# Altium schematic sheet mipi_serializer2.SchDoc
size A3; DrawnBy: Elio F; Engineer: Elio F; Revision: A; SheetNumber: 9; SheetTotal: 11; Sheet Title: Mipi Serializer CAM2
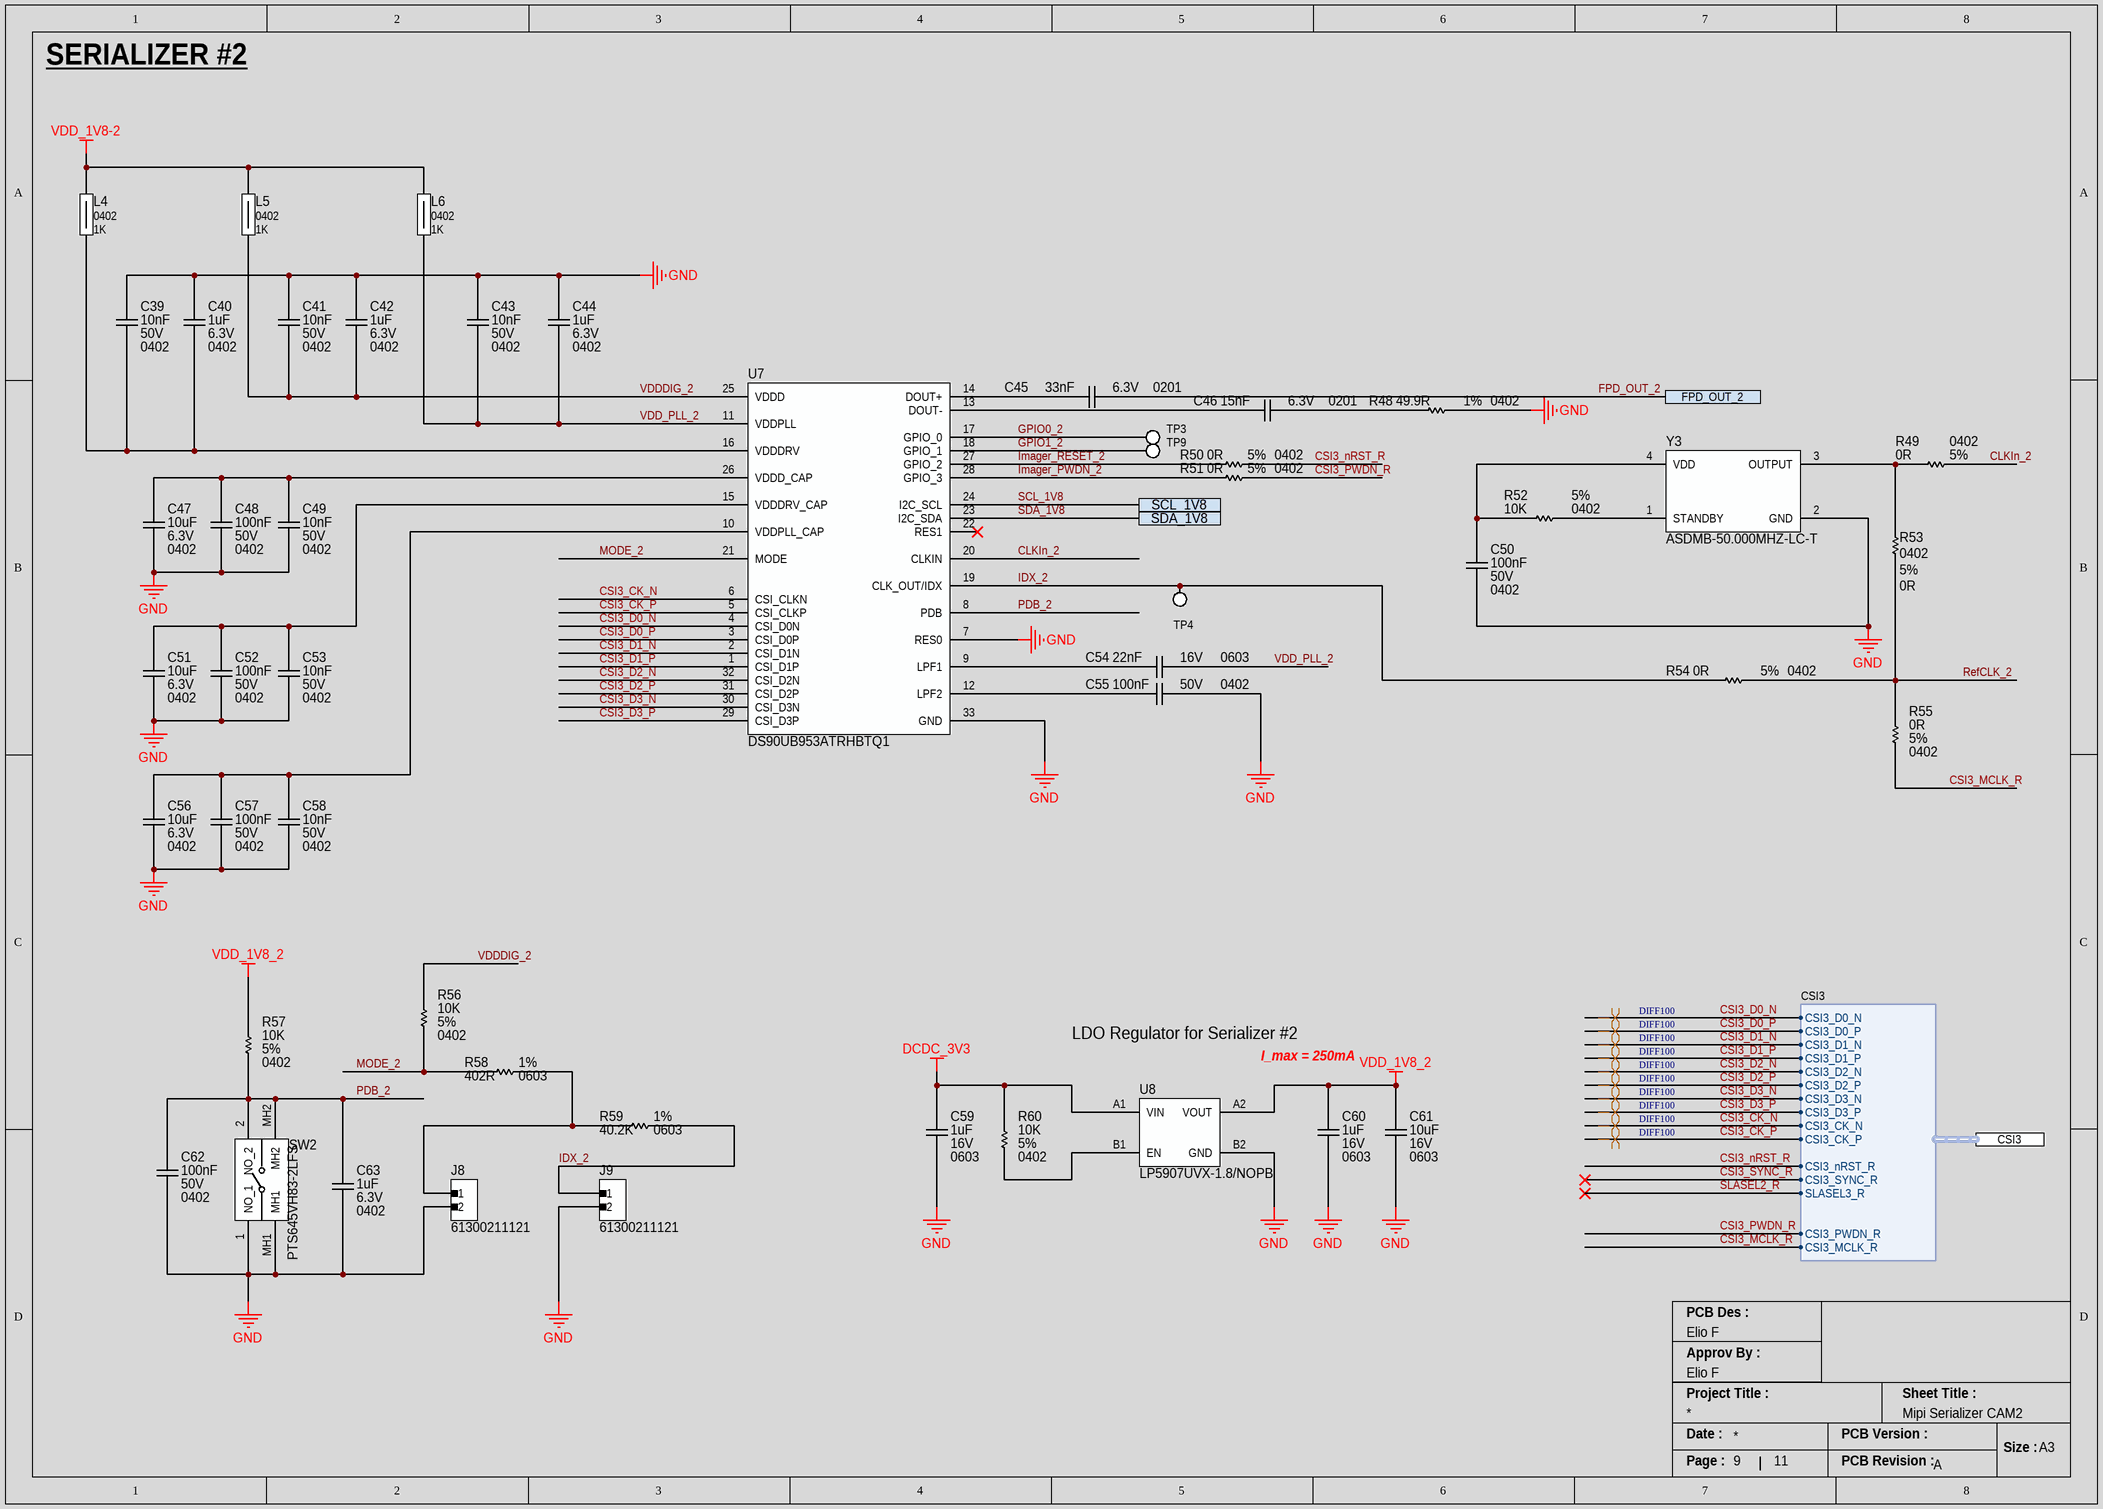
[diagram p0: mipi_serializer2.SchDoc]

## Parts
C39  Voltage Rating: 50V  Capacitance: 10nF  Case/Package: 0402  [CAP_0402_CAPC1005X05N]  (hidden comment: GRM155R71H103KA88D)
C40  Capacitance: 1uF  Voltage Rating: 6.3V  Case Code (Imperial): 0402  [CAP_0402_CAPC1005X05N]  (hidden comment: CL05B105KQ5NQNC)
C41  Voltage Rating: 50V  Capacitance: 10nF  Case/Package: 0402  [CAP_0402_CAPC1005X05N]  (hidden comment: GRM155R71H103KA88D)
C42  Capacitance: 1uF  Voltage Rating: 6.3V  Case Code (Imperial): 0402  [CAP_0402_CAPC1005X05N]  (hidden comment: CL05B105KQ5NQNC)
C43  Voltage Rating: 50V  Capacitance: 10nF  Case/Package: 0402  [CAP_0402_CAPC1005X05N]  (hidden comment: GRM155R71H103KA88D)
C44  Capacitance: 1uF  Voltage Rating: 6.3V  Case Code (Imperial): 0402  [CAP_0402_CAPC1005X05N]  (hidden comment: CL05B105KQ5NQNC)
C45  Voltage Rating: 6.3V  Capacitance: 33nF  Case/Package: 0201  [CAP_0201_CAPC0603X03N]  (hidden comment: GRM033R60J333KE01D)
C46  Voltage Rating: 6.3V  Capacitance: 15nF  Case/Package: 0201  [CAP_0201_CAPC0603X03N]  (hidden comment: GRM033R60J153KE01D)
C47  Case/Package: 0402  Capacitance: 10uF  Voltage Rating: 6.3V  [CAP_0402_CAPC1005X05N]  (hidden comment: CL05A106MQ5NUNC)
C48  Voltage Rating: 50V  Capacitance: 100nF  Case/Package: 0402  [CAP_0402_CAPC1005X05N]  (hidden comment: GRM155R71H104KE14D)
C49  Voltage Rating: 50V  Capacitance: 10nF  Case/Package: 0402  [CAP_0402_CAPC1005X05N]  (hidden comment: GRM155R71H103KA88D)
C50  Voltage Rating: 50V  Capacitance: 100nF  Case/Package: 0402  [CAP_0402_CAPC1005X05N]  (hidden comment: GRM155R71H104KE14D)
C51  Case/Package: 0402  Capacitance: 10uF  Voltage Rating: 6.3V  [CAP_0402_CAPC1005X05N]  (hidden comment: CL05A106MQ5NUNC)
C52  Voltage Rating: 50V  Capacitance: 100nF  Case/Package: 0402  [CAP_0402_CAPC1005X05N]  (hidden comment: GRM155R71H104KE14D)
C53  Voltage Rating: 50V  Capacitance: 10nF  Case/Package: 0402  [CAP_0402_CAPC1005X05N]  (hidden comment: GRM155R71H103KA88D)
C54  Voltage Rating (DC): 16V  Capacitance: 22nF  Case/Package: 0603  [CAP_0603_CAPC1608X08N]  (hidden comment: C0603C223K4RACTU)
C55  Voltage Rating: 50V  Capacitance: 100nF  Case/Package: 0402  [CAP_0402_CAPC1005X05N]  (hidden comment: GRM155R71H104KE14D)
C56  Case/Package: 0402  Capacitance: 10uF  Voltage Rating: 6.3V  [CAP_0402_CAPC1005X05N]  (hidden comment: CL05A106MQ5NUNC)
C57  Voltage Rating: 50V  Capacitance: 100nF  Case/Package: 0402  [CAP_0402_CAPC1005X05N]  (hidden comment: GRM155R71H104KE14D)
C58  Voltage Rating: 50V  Capacitance: 10nF  Case/Package: 0402  [CAP_0402_CAPC1005X05N]  (hidden comment: GRM155R71H103KA88D)
C59  Voltage Rating: 16V  Capacitance: 1uF  Case/Package: 0603  [CAP_0603_CAPC1608X08N]  (hidden comment: CL10A105KO8NNNC)
C60  Voltage Rating: 16V  Capacitance: 1uF  Case/Package: 0603  [CAP_0603_CAPC1608X08N]  (hidden comment: CL10A105KO8NNNC)
C61  Voltage Rating: 16V  Capacitance: 10uF  Case/Package: 0603  [CAP_0603_CAPC1608X08N]  (hidden comment: GRM188R61C106MAALD)
C62  Voltage Rating: 50V  Capacitance: 100nF  Case/Package: 0402  [CAP_0402_CAPC1005X05N]  (hidden comment: GRM155R71H104KE14D)
C63  Capacitance: 1uF  Voltage Rating: 6.3V  Case Code (Imperial): 0402  [CAP_0402_CAPC1005X05N]  (hidden comment: CL05B105KQ5NQNC)
J8  61300211121  [HEADER_MALE_HDRV2W110P0X254_1X2_508X254X854P]
J9  61300211121  [HEADER_MALE_HDRV2W110P0X254_1X2_508X254X854P]
L4  Case/Package: 0402  Impedance: 1K  [IND_0402]  (hidden comment: *BLM15AX102SN1D)
L5  Case/Package: 0402  Impedance: 1K  [IND_0402]  (hidden comment: *BLM15AX102SN1D)
L6  Case/Package: 0402  Impedance: 1K  [IND_0402]  (hidden comment: *BLM15AX102SN1D)
R48  Resistance: 49.9R  Tolerance: 1%  Case/Package: 0402  [RES_0402_RESC1005X04N]  (hidden comment: CR0402-FX-49R9GLF)
R49  Case Code (Imperial): 0402  Tolerance: 5%  Resistance: 0R  [RES_0402_RESC1005X04N]  (hidden comment: ERJ-2GE0R00X)
R50  Case Code (Imperial): 0402  Tolerance: 5%  Resistance: 0R  [RES_0402_RESC1005X04N]  (hidden comment: ERJ-2GE0R00X)
R51  Case Code (Imperial): 0402  Tolerance: 5%  Resistance: 0R  [RES_0402_RESC1005X04N]  (hidden comment: ERJ-2GE0R00X)
R52  Tolerance: 5%  Resistance: 10K  Case/Package: 0402  [RES_0402_RESC1005X04N]  (hidden comment: ERJ-2GEJ103X)
R53  Case Code (Imperial): 0402  Tolerance: 5%  Resistance: 0R  [RES_0402_RESC1005X04N]  (hidden comment: ERJ-2GE0R00X)
R54  Case Code (Imperial): 0402  Tolerance: 5%  Resistance: 0R  [RES_0402_RESC1005X04N]  (hidden comment: ERJ-2GE0R00X)
R55  Case Code (Imperial): 0402  Tolerance: 5%  Resistance: 0R  [RES_0402_RESC1005X04N]  (hidden comment: ERJ-2GE0R00X)
R56  Tolerance: 5%  Resistance: 10K  Case/Package: 0402  [RES_0402_RESC1005X04N]  (hidden comment: ERJ-2GEJ103X)
R57  Tolerance: 5%  Resistance: 10K  Case/Package: 0402  [RES_0402_RESC1005X04N]  (hidden comment: ERJ-2GEJ103X)
R58  Tolerance: 1%  Resistance: 402R  Case/Package: 0603  [RES_0603_RESC1608X04N]  (hidden comment: CRCW0603402RFKEA)
R59  Tolerance: 1%  Resistance: 40.2K  Case/Package: 0603  [RES_0603_RESC1608X04N]  (hidden comment: RC0603FR-0740K2L)
R60  Tolerance: 5%  Resistance: 10K  Case/Package: 0402  [RES_0402_RESC1005X04N]  (hidden comment: ERJ-2GEJ103X)
SW2  PTS645VH83-2LFS  [SW_RA_PTS645VH832LFS]
TP3  NO COMPONENT  [TP_PAD_1.6MM_SMD_ROUND]  (value not drawn)  (no BOM)
TP4  NO COMPONENT  [TP_PAD_1.6MM_SMD_ROUND]  (value not drawn)  (no BOM)
TP9  NO COMPONENT  [TP_PAD_1.6MM_SMD_ROUND]  (value not drawn)  (no BOM)
U7  DS90UB953ATRHBTQ1  [IC_SERIALIZER_QFN50P500X500X100-33N-D]
U8  LP5907UVX-1.8/NOPB  [IC_REG_LDO_BGA4C35P2X2_71X71X40]
Y3  ASDMB-50.000MHZ-LC-T  [XTAL_ASDMB-50.000MHZ-LC-T]

## Ports
CSI3 (harness CSI3), FPD_OUT_2, SCL_1V8, SDA_1V8

## Harnesses
CSI3: CSI3_D0_N, CSI3_D0_P, CSI3_D1_N, CSI3_D1_P, CSI3_D2_N, CSI3_D2_P, CSI3_D3_N, CSI3_D3_P, CSI3_CK_N, CSI3_CK_P, CSI3_nRST_R, CSI3_SYNC_R, SLASEL3_R, CSI3_PWDN_R, CSI3_MCLK_R

## Nets
DCDC_3V3: C59.2 R60.2 U8.A1(VIN)
GND: C39.2 C40.2 C41.2 C42.2 C43.2 C44.2 C47.1 C48.1 C49.1 C50.1 C51.1 C52.1 C53.1 C55.1 C56.1 C57.1 C58.1 C59.1 C60.1 C61.1 C62.1 C63.1 J8.2 J9.2 R48.2 SW2.1(NO_1) SW2.MH1 U7.7(RES0) U7.33(GND) U8.B2(GND) Y3.2(GND)
VDD_1V8-2: L4.2 L5.2 L6.2
VDD_1V8_2: C60.2 C61.2 R57.2 U8.A2(VOUT)
CLKIn_2: R49.2 U7.20(CLKIN)
CSI3_CK_N: U7.6(CSI_CLKN) ; port CSI3.CSI3_CK_N
CSI3_CK_P: U7.5(CSI_CLKP) ; port CSI3.CSI3_CK_P
CSI3_D0_N: U7.4(CSI_D0N) ; port CSI3.CSI3_D0_N
CSI3_D0_P: U7.3(CSI_D0P) ; port CSI3.CSI3_D0_P
CSI3_D1_N: U7.2(CSI_D1N) ; port CSI3.CSI3_D1_N
CSI3_D1_P: U7.1(CSI_D1P) ; port CSI3.CSI3_D1_P
CSI3_D2_N: U7.32(CSI_D2N) ; port CSI3.CSI3_D2_N
CSI3_D2_P: U7.31(CSI_D2P) ; port CSI3.CSI3_D2_P
CSI3_D3_N: U7.30(CSI_D3N) ; port CSI3.CSI3_D3_N
CSI3_D3_P: U7.29(CSI_D3P) ; port CSI3.CSI3_D3_P
CSI3_MCLK_R: R55.1 ; port CSI3.CSI3_MCLK_R
CSI3_nRST_R: R50.2 ; port CSI3.CSI3_nRST_R
CSI3_PWDN_R: R51.2 ; port CSI3.CSI3_PWDN_R
CSI3_SYNC_R: port CSI3.CSI3_SYNC_R
FPD_OUT_2: C45.2 ; port FPD_OUT_2
GPIO0_2: TP3.1 U7.17(GPIO_0)
GPIO1_2: TP9.1 U7.18(GPIO_1)
IDX_2: J9.1 R54.2 R59.2 TP4.1 U7.19(CLK_OUT/IDX)
Imager_PWDN_2: R51.1 U7.28(GPIO_3)
Imager_RESET_2: R50.1 U7.27(GPIO_2)
MODE_2: R56.1 R58.1 U7.21(MODE)
PDB_2: C62.2 C63.2 R57.1 SW2.2(NO_2) SW2.MH2 U7.8(PDB)
RefCLK_2: R53.1 R54.1 R55.2
SCL_1V8: U7.24(I2C_SCL) ; port SCL_1V8
SDA_1V8: U7.23(I2C_SDA) ; port SDA_1V8
SLASEL2_R: port CSI3.SLASEL3_R
VDD_PLL_2: C43.1 C44.1 C54.2 L6.1 U7.11(VDDPLL)
VDDDIG_2: C41.1 C42.1 L5.1 R56.2 U7.25(VDDD)
NetC39_1: C39.1 C40.1 L4.1 U7.16(VDDDRV)
NetC45_1: C45.1 U7.14(DOUT+)
NetC46_1: C46.1 U7.13(DOUT-)
NetC46_2: C46.2 R48.1
NetC47_2: C47.2 C48.2 C49.2 U7.26(VDDD_CAP)
NetC50_2: C50.2 R52.1 Y3.4(VDD)
NetC51_2: C51.2 C52.2 C53.2 U7.15(VDDDRV_CAP)
NetC54_1: C54.1 U7.9(LPF1)
NetC55_2: C55.2 U7.12(LPF2)
NetC56_2: C56.2 C57.2 C58.2 U7.10(VDDPLL_CAP)
NetJ8_1: J8.1 R58.2 R59.1
NetR49_1: R49.1 R53.2 Y3.3(OUTPUT)
NetR52_2: R52.2 Y3.1(STANDBY)
NetR60_1: R60.1 U8.B1(EN)

Not connected (* = marked no-connect by the designer): U7 22(RES1)*

## Layout directives
differential pair; differential pair class DIFF100: CSI3_CK_N, CSI3_CK_P, CSI3_D0_N, CSI3_D0_P, CSI3_D1_N, CSI3_D1_P, CSI3_D2_N, CSI3_D2_P, CSI3_D3_N, CSI3_D3_P

## Notes on the sheet
- SERIALIZER #2
- LDO Regulator for Serializer #2
- I_max = 250mA
- PCB Des :
- Approv By :
- Project Title :
- Sheet Title :
- Date :
- PCB Version :
- Size :
- A3
- Page :
- PCB Revision :

## Library data of the parts
C39 C41 C43 C49 C53 C58 = CAP_10nF_50V_X7R_0402: Multilayer Ceramic Capacitors MLCC Surface Mount 0402 0.01uF 50 Volts X7R 10%; Manufacturer: Murata; Voltage: 25V; Supplier 1: Digikey; Manufacturer Part Number: GRM155R71H103KA88D; RoHS: Yes; Category: Ceramic Capacitors; Stock 1: 5190059; Pricing 1: 1=0.1, 10=0.023, 50=0.013, 100=0.0101, 500=0.0076, 1000=0.00598, 2500=0.00543, 5000=0.005 (USD); Mount: Surface Mount; Number of Pins: 2; Case Code (Metric): 1005; Case Code (Imperial): 0402; Material: Ceramic; Min Operating Temperature: -55°C; Max Operating Temperature: 125°C; Tolerance: 10%; Packaging: Tape and Reel; Package Quantity: 1; Dielectric: X7R; Termination: SMD/SMT; Series: GRM; Construction: Flat; Voltage Rating (DC): 50V; Length: 1mm; Width: 0.02inch; Height: 0.5mm; Thickness: 0.022inch; Depth: 0.5mm; Radiation Hardening: No; Reach SVHC Compliant: No; RoHS Compliant: Yes; Lead Free: 5697LeadFree; ComponentLink1URL: https://datasheet.ciiva.com/22698/1747449-22698420.pdf?src-supplier=Element14; ComponentLink1Description: https://datasheet.ciiva.com/22698/1747449-22698420.pdf?src-supplier=Element14; ComponentLink2URL: https://datasheet.ciiva.com/19476/1856433-19476546.pdf?src-supplier=Jameco; ComponentLink2Description: https://datasheet.ciiva.com/19476/1856433-19476546.pdf?src-supplier=Jameco; ComponentLink3URL: https://datasheet.ciiva.com/129/product-129810.pdf?src-supplier=Digikey; ComponentLink3Description: https://datasheet.ciiva.com/129/product-129810.pdf?src-supplier=Digikey; ComponentLink4URL: https://datasheet.ciiva.com/11786/0900766b80ef921d-11786340.pdf?src-supplier=Rs; ComponentLink4Description: https://datasheet.ciiva.com/11786/0900766b80ef921d-11786340.pdf?src-supplier=Rs; ComponentLink5URL: https://datasheet.ciiva.com/18100/getdatasheetpartid-27434-18100660.pdf?src-supplier=Verical; ComponentLink5Description: https://datasheet.ciiva.com/18100/getdatasheetpartid-27434-18100660.pdf?src-supplier=Verical; ComponentLink6URL: https://datasheet.ciiva.com/29199/454225-da-01-en-vs-kondensator-0402-29199740.pdf?src-supplier=Conrad; ComponentLink6Description: https://datasheet.ciiva.com/29199/454225-da-01-en-vs-kondensator-0402-29199740.pdf?src-supplier=Conrad; ComponentLink7URL: https://datasheet.ciiva.com/129/grm155r71h103ka88-01-129811.pdf?src-supplier=Digikey; ComponentLink7Description: https://datasheet.ciiva.com/129/grm155r71h103ka88-01-129811.pdf?src-supplier=Digikey; ComponentLink8URL: https://datasheet.ciiva.com/129/grm155r71h103ka88-01-129812.pdf?src-supplier=Digikey; ComponentLink8Description: https://datasheet.ciiva.com/129/grm155r71h103ka88-01-129812.pdf?src-supplier=Digikey; ComponentLink9URL: https://datasheet.ciiva.com/5410/product-5410990.pdf?src-supplier=Mouser; ComponentLink9Description: https://datasheet.ciiva.com/5410/product-5410990.pdf?src-supplier=Mouser; ComponentLink10URL: https://datasheet.ciiva.com/16495/product-16495290.pdf?src-supplier=Future+Electronics; ComponentLink10Description: https://datasheet.ciiva.com/16495/product-16495290.pdf?src-supplier=Future+Electronics; Supplier Part Number 1: 490-4516-6-ND
C40 C42 C44 C63 = CAP_1uF_6.3V_X7R_0402: Multilayer Ceramic Capacitor, 1 uF, 6.3 V, ï¿½ 10%, X7R, 0402 [1005 Metric]; Manufacturer: Samsung; Supplier 1: Digikey; Manufacturer Part Number: CL05B105KQ5NQNC; RoHS: Yes; Category: Ceramic Capacitors; Stock 1: 242595; Pricing 1: 1=0.15, 10=0.099, 50=0.0594, 100=0.0467, 500=0.0345, 1000=0.02856, 2500=0.02658, 5000=0.02432 (USD); Mount: Surface Mount; Case/Package: 0402; Case Code (Metric): 1005; Material: Ceramic; Min Operating Temperature: -55°C; Max Operating Temperature: 125°C; Tolerance: 10%; Packaging: Tape and Reel; Package Quantity: 1; Series: CL; Length: 0.039inch; Width: 0.02inch; Thickness: 0.022inch; Depth: 0.5mm; Lead Free: Lead Free; RoHS Compliant: Yes; ComponentLink1URL: https://datasheet.ciiva.com/25797/cl05b105kq5nqnc-25797457.pdf?src-supplier=Digikey; ComponentLink1Description: https://datasheet.ciiva.com/25797/cl05b105kq5nqnc-25797457.pdf?src-supplier=Digikey; Supplier Part Number 1: 1276-1513-1-ND; Dielectric: X7R
C45 = CAP_0.033uF_6.3V_X5R_0201: Multilayer Ceramic Capacitor, 0.033 uF, 6.3 V, ± 10%, X5R, 0201 [0603 Metric]; Manufacturer: Murata; Dissipation Factor: 0.1%; Supplier 1: Mouser; Manufacturer Part Number: GRM033R60J333KE01D; RoHS: Yes; Category: Ceramic Capacitors; Stock 1: 164761; Pricing 1: 1=0.1, 10=0.017, 50=0.017, 100=0.011, 1000=0.01, 10000=0.008 (USD); Mount: Surface Mount; Case Code (Metric): 0603; Case Code (Imperial): 0201; Material: Ceramic; Min Operating Temperature: -55°C; Max Operating Temperature: 85°C; Tolerance: 10%; Packaging: Tape and Reel; Voltage Rating (DC): 6.3V; Package Quantity: 1; Dielectric: X5R; Termination: SMD/SMT; Voltage: 6.3V; Series: GRM; Construction: Flat; Length: 0.6mm; Width: 0.012inch; Height: 0.3mm; Thickness: 0.013inch; Depth: 0.3mm; Radiation Hardening: No; Reach SVHC Compliant: No; Lead Free: Lead Free; RoHS Compliant: Yes; ComponentLink1URL: https://datasheet.ciiva.com/131/product-131104.pdf?src-supplier=Digikey; ComponentLink1Description: https://datasheet.ciiva.com/131/product-131104.pdf?src-supplier=Digikey; ComponentLink2URL: https://datasheet.ciiva.com/18184/getdatasheetpartid-220776-18184045.pdf?src-supplier=Verical; ComponentLink2Description: https://datasheet.ciiva.com/18184/getdatasheetpartid-220776-18184045.pdf?src-supplier=Verical; ComponentLink3URL: https://datasheet.ciiva.com/29199/455665-da-01-en-vs-kondensator-0201-29199269.pdf?src-supplier=Conrad; ComponentLink3Description: https://datasheet.ciiva.com/29199/455665-da-01-en-vs-kondensator-0201-29199269.pdf?src-supplier=Conrad; ComponentLink4URL: https://datasheet.ciiva.com/11605/product-11605453.pdf?src-supplier=Avnet; ComponentLink4Description: https://datasheet.ciiva.com/11605/product-11605453.pdf?src-supplier=Avnet; ComponentLink5URL: https://datasheet.ciiva.com/16199/product-16199350.pdf?src-supplier=Future+Electronics; ComponentLink5Description: https://datasheet.ciiva.com/16199/product-16199350.pdf?src-supplier=Future+Electronics; Supplier Part Number 1: 81-GRM033R60J333KE01
C46 = CAP_0.015uF_6.3V_X5R_0201: 0201 15 nF 6.3 V ±10% Tolerance X5R SMT Multilayer Ceramic Capacitor; Manufacturer: Murata; Supplier 1: Mouser; Manufacturer Part Number: GRM033R60J153KE01D; RoHS: Yes; Category: Ceramic Capacitors; Stock 1: 84989; Pricing 1: 1=0.1, 10=0.014, 50=0.014, 100=0.007, 1000=0.005, 10000=0.005 (USD); Mount: Surface Mount; Case Code (Metric): 0603; Case Code (Imperial): 0201; Material: Ceramic; Min Operating Temperature: -55°C; Max Operating Temperature: 85°C; Package Quantity: 1; Tolerance: 10%; Packaging: Tape and Reel; Voltage Rating (DC): 6.3V; Dielectric: X5R; Termination: SMD/SMT; Series: GRM; Construction: Flat; Length: 0.6mm; Width: 0.012inch; Height: 0.3mm; Thickness: 0.013inch; Depth: 0.3mm; Radiation Hardening: No; Lead Free: Lead Free; RoHS Compliant: Yes; ComponentLink1URL: https://datasheet.ciiva.com/130/product-130817.pdf?src-supplier=Digikey; ComponentLink1Description: https://datasheet.ciiva.com/130/product-130817.pdf?src-supplier=Digikey; ComponentLink2URL: https://datasheet.ciiva.com/18184/getdatasheetpartid-306886-18184038.pdf?src-supplier=Verical; ComponentLink2Description: https://datasheet.ciiva.com/18184/getdatasheetpartid-306886-18184038.pdf?src-supplier=Verical; ComponentLink3URL: https://datasheet.ciiva.com/29199/455637-da-01-en-vs-kondensator-0201-29199258.pdf?src-supplier=Conrad; ComponentLink3Description: https://datasheet.ciiva.com/29199/455637-da-01-en-vs-kondensator-0201-29199258.pdf?src-supplier=Conrad; ComponentLink4URL: https://datasheet.ciiva.com/130/grm033r60j153ke01-01-130818.pdf?src-supplier=Digikey; ComponentLink4Description: https://datasheet.ciiva.com/130/grm033r60j153ke01-01-130818.pdf?src-supplier=Digikey; ComponentLink5URL: https://datasheet.ciiva.com/130/grm033r60j153ke01-01-130819.pdf?src-supplier=Digikey; ComponentLink5Description: https://datasheet.ciiva.com/130/grm033r60j153ke01-01-130819.pdf?src-supplier=Digikey; ComponentLink6URL: https://datasheet.ciiva.com/11619/product-11619495.pdf?src-supplier=Avnet; ComponentLink6Description: https://datasheet.ciiva.com/11619/product-11619495.pdf?src-supplier=Avnet; Supplier Part Number 1: 81-GRM033R60J153KE1D
C47 C51 C56 = CAP_10UF_6.3V_X5R_0402: Cap Ceramic 10uF 6.3V X5R 20% SMD 0402 85C T/R; Manufacturer: Samsung; Supplier 1: Digikey; Manufacturer Part Number: CL05A106MQ5NUNC; RoHS: Yes; Category: Ceramic Capacitors; Stock 1: 6097180; Pricing 1: 1=0.24, 10=0.153, 50=0.0968, 100=0.0774, 500=0.05588, 1000=0.04943, 2500=0.04728, 5000=0.04299 (USD); Mount: Surface Mount; Case Code (Metric): 1005; Case Code (Imperial): 0402; Min Operating Temperature: -55°C; Max Operating Temperature: 85°C; Packaging: Tape and Reel; Tolerance: 20%; Dielectric: X5R; Series: CL; Package Quantity: 1; Construction: Flat; Length: 1mm; Width: 0.02inch; Height: 0.5mm; Depth: 0.5mm; Thickness: 0.028inch; Radiation Hardening: No; RoHS Compliant: Yes; ComponentLink1URL: https://datasheet.ciiva.com/16437/cl05a106mq5nunc-16437356.pdf?src-supplier=Future+Electronics; ComponentLink1Description: https://datasheet.ciiva.com/16437/cl05a106mq5nunc-16437356.pdf?src-supplier=Future+Electronics; ComponentLink2URL: https://datasheet.ciiva.com/26877/getdatasheetpartid-355289-26877841.pdf?src-supplier=Verical; ComponentLink2Description: https://datasheet.ciiva.com/26877/getdatasheetpartid-355289-26877841.pdf?src-supplier=Verical; Supplier Part Number 1: 1276-1451-1-ND
C48 C50 C52 C55 C57 C62 = CAP_100NF_50V_X7R_0402: Multilayer Ceramic Capacitor, 0.1 uF, 16 V, ± 10%, X7R, 0402 [1005 Metric]; Manufacturer: Murata; Dissipation Factor: 0.025%; Temperature Coefficient: 30ppm/°C; Supplier 1: DigiKey; Manufacturer Part Number: GRM155R71H104KE14D; RoHS: Yes; Category: Ceramic Capacitors; Stock 1: 13730790; Pricing 1: 1=0.1, 10=0.023, 50=0.0132, 100=0.0102, 500=0.00768, 1000=0.00603, 2500=0.00548, 5000=0.00504 (USD); Mount: Surface Mount; Number of Pins: 2NUMBER; Case Code (Metric): 1005; Material: Ceramic; Case Code (Imperial): 0402; Weight: 0.000212oz; Dielectric Material: Ceramic; Min Operating Temperature: -55°C; Max Operating Temperature: 125°C; Packaging: Tape and Reel; Package Quantity: 10000; Series: GRM; Tolerance: 10%; Dielectric: X7R; Termination: SMD/SMT; Voltage: 50V; Voltage Rating (DC): 50V; Construction: Flat; Length: 1mm; Width: 0.5mm; Height: 0.5mm; Depth: 0.5mm; Thickness: 0.022inch; Reach SVHC Compliant: No; RoHS Compliant: Yes; Lead Free: 5697LeadFree; ComponentLink1URL: http://www.farnell.com/datasheets/2079156.pdf?src-supplier=Farnell; ComponentLink1Description: http://www.farnell.com/datasheets/2079156.pdf?src-supplier=Farnell; ComponentLink2URL: http://www.mouser.com/ds/2/281/c02e-2905.pdf?src-supplier=Mouser; ComponentLink2Description: http://www.mouser.com/ds/2/281/c02e-2905.pdf?src-supplier=Mouser; ComponentLink3URL: http://www.farnell.com/datasheets/2079156.pdf?src-supplier=Newark; ComponentLink3Description: http://www.farnell.com/datasheets/2079156.pdf?src-supplier=Newark; ComponentLink4URL: https://datasheet.octopart.com/GRM155R71H104KE14D-Murata-datasheet-22122223.pdf?src-supplier=Future+Electronics; ComponentLink4Description: https://datasheet.octopart.com/GRM155R71H104KE14D-Murata-datasheet-22122223.pdf?src-supplier=Future+Electronics; ComponentLink5URL: https://search.murata.co.jp/Ceramy/image/img/A01X/G101/ENG/GRM155R71H104KE14-01.pdf?src-supplier=Digi-Key; ComponentLink5Description: https://search.murata.co.jp/Ceramy/image/img/A01X/G101/ENG/GRM155R71H104KE14-01.pdf?src-supplier=Digi-Key; ComponentLink6URL: http://psearch.en.murata.com/capacitor/product/GRM155R71H104KE14%23.pdf?src-supplier=Avnet; ComponentLink6Description: http://psearch.en.murata.com/capacitor/product/GRM155R71H104KE14%23.pdf?src-supplier=Avnet; ComponentLink7URL: https://datasheet.octopart.com/GRM155R71H104KE14D-Murata-datasheet-66077078.pdf?src-supplier=Element14; ComponentLink7Description: https://datasheet.octopart.com/GRM155R71H104KE14D-Murata-datasheet-66077078.pdf?src-supplier=Element14; Supplier Part Number 1: 490-10700-6-ND; Supplier 2: Digikey; Stock 2: 3706055; Pricing 2: 1=0.1, 10=0.037, 50=0.021, 100=0.0162, 500=0.01224, 1000=0.00961, 2500=0.00874, 5000=0.00804 (USD); Halogen Free: 5694HalogenFree; ComponentLink8URL: http://www.mouser.com/ds/2/447/UPY-GPHC_X5R_4V-to-50V_25-1131599.pdf?src-supplier=Mouser; ComponentLink8Description: http://www.mouser.com/ds/2/447/UPY-GPHC_X5R_4V-to-50V_25-1131599.pdf?src-supplier=Mouser; ComponentLink9URL: https://datasheet.octopart.com/CC0402KRX5R8BB104-Yageo-datasheet-137700082.pdf?src-supplier=Future+Electronics; ComponentLink9Description: https://datasheet.octopart.com/CC0402KRX5R8BB104-Yageo-datasheet-137700082.pdf?src-supplier=Future+Electronics; ComponentLink10URL: http://www.yageo.com/documents/recent/UPY-GPHC_X5R_4V-to-50V_25.pdf?src-supplier=Digikey; ComponentLink10Description: http://www.yageo.com/documents/recent/UPY-GPHC_X5R_4V-to-50V_25.pdf?src-supplier=Digikey; ComponentLink11URL: https://datasheet.octopart.com/CC0402KRX5R8BB104-Yageo-datasheet-140260304.pdf?src-supplier=Newark; ComponentLink11Description: https://datasheet.octopart.com/CC0402KRX5R8BB104-Yageo-datasheet-140260304.pdf?src-supplier=Newark; ComponentLink12URL: https://datasheet.octopart.com/CC0402KRX5R8BB104-Yageo-datasheet-170350636.pdf?src-supplier=Future+Electronics; ComponentLink12Description: https://datasheet.octopart.com/CC0402KRX5R8BB104-Yageo-datasheet-170350636.pdf?src-supplier=Future+Electronics; ComponentLink13URL: http://www.yageo.com/documents/recent/UPY-GPHC_X5R_4V-to-50V-16.pdf?src-supplier=Future+Electronics; ComponentLink13Description: http://www.yageo.com/documents/recent/UPY-GPHC_X5R_4V-to-50V-16.pdf?src-supplier=Future+Electronics; Supplier Part Number 2: 311-1697-1-ND
C54 = CAP_22nF_16V_X7R_0603: Multilayer Ceramic Capacitor, 0.022 uF, 16 V, ± 10%, X7R, 0603 [1608 Metric]; Manufacturer: KEMET; Supplier 1: Digikey; Manufacturer Part Number: C0603C223K4RACTU; RoHS: Yes; Category: Ceramic Capacitors; Stock 1: 159667; Pricing 1: 1=0.1, 10=0.053, 50=0.0304, 100=0.0235, 500=0.01768, 1000=0.01389 (USD); Mount: Surface Mount; Case Code (Imperial): 0603; Case Code (Metric): 1608; Weight: 7.1E-05oz; Min Operating Temperature: -55°C; Max Operating Temperature: 125°C; Tolerance: 10%; Dielectric: X7R; Packaging: Tape and Reel; Package Quantity: 1; Termination: SMD/SMT; Series: C; Voltage Rating: 16V; Construction: Flat; Length: 1.6mm; Width: 0.031inch; Height: 0.8mm; Thickness: 0.034inch; Depth: 0.8mm; Radiation Hardening: No; RoHS Compliant: Yes; Reach SVHC Compliant: No; ComponentLink1URL: https://datasheet.ciiva.com/49516/1636924-49516646.pdf?src-supplier=Jameco; ComponentLink1Description: https://datasheet.ciiva.com/49516/1636924-49516646.pdf?src-supplier=Jameco; ComponentLink2URL: https://datasheet.ciiva.com/26847/getdatasheetpartid-724406-26847612.pdf?src-supplier=Verical; ComponentLink2Description: https://datasheet.ciiva.com/26847/getdatasheetpartid-724406-26847612.pdf?src-supplier=Verical; ComponentLink3URL: https://datasheet.ciiva.com/14599/70095383-14599397.pdf?src-supplier=Allied+Electronics; ComponentLink3Description: https://datasheet.ciiva.com/14599/70095383-14599397.pdf?src-supplier=Allied+Electronics; ComponentLink4URL: https://datasheet.ciiva.com/14601/70095383-14601245.pdf?src-supplier=Allied+Electronics; ComponentLink4Description: https://datasheet.ciiva.com/14601/70095383-14601245.pdf?src-supplier=Allied+Electronics; Supplier Part Number 1: 399-C0603C223K4RAC7867CT-ND
C59 C60 = CAP_1UF_16V_X5R_0603: CAP CER 1UF 16V X5R 0603; Manufacturer: Samsung; Material: Ceramic; Tolerance: 10%; Manufacturer Part Number: CL10A105KO8NNNC; RoHS: Yes; Category: Ceramic Capacitors; Stock 1: 252255; Pricing 1: 1=0.10000, 10=0.03300, 50=0.01800, 100=0.01470, 500=0.01050, 1000=0.00825 (USD); Mount: Surface Mount; Case Code (Metric): 1608; Case Code (Imperial): 0603; Contact Plating: Tin; Min Operating Temperature: -55°C; Max Operating Temperature: 85°C; Package Quantity: 1; Packaging: Tape and Reel; Dielectric: X5R; Voltage Rating (DC): 16V; Series: CL; Voltage: 16V; Construction: Flat; Length: 1.6mm; Width: 0.031inch; Height: 0.8mm; Thickness: 0.035inch; Depth: 0.8mm; Radiation Hardening: No; Lead Free: Lead Free; RoHS Compliant: Yes; ComponentLink1URL: https://datasheet.ciiva.com/16199/cl10a105ko8nnnc-16199033.pdf?src-supplier=Future+Electronics; ComponentLink1Description: https://datasheet.ciiva.com/16199/cl10a105ko8nnnc-16199033.pdf?src-supplier=Future+Electronics; ComponentLink2URL: https://datasheet.ciiva.com/15195/getdatasheetpartid-359688-15195706.pdf?src-supplier=Verical; ComponentLink2Description: https://datasheet.ciiva.com/15195/getdatasheetpartid-359688-15195706.pdf?src-supplier=Verical; ComponentLink3URL: https://datasheet.ciiva.com/29198/458190-da-01-en-vs-kondensator-0603-29198480.pdf?src-supplier=Conrad; ComponentLink3Description: https://datasheet.ciiva.com/29198/458190-da-01-en-vs-kondensator-0603-29198480.pdf?src-supplier=Conrad; Supplier 1: Digi-Key; Supplier 2: Mouser; Supplier 3: Newark; Supplier Part Number 1: 1276-1034-1-ND; Supplier Part Number 2: 187-CL10A105KO8NNNC; Supplier Part Number 3: 82AC9279
C61 = CAP_10UF_16V_X5R_0603: 0603 10 uF 16 V ±20% Tolerance X5R Multilayer Ceramic Chip Capacitor; Manufacturer: Murata; Manufacturer Part Number: GRM188R61C106MAALD; RoHS: Yes; Category: Ceramic Capacitors; Stock 1: 566627; Pricing 1: 1=0.24000, 10=0.16500, 50=0.11000, 100=0.09340, 500=0.06596, 1000=0.05771 (USD); Mount: Surface Mount; Case Code (Metric): 1608; Material: Ceramic; Case Code (Imperial): 0603; Min Operating Temperature: -55°C; Max Operating Temperature: 85°C; Tolerance: 20%; Packaging: Cut Tape; Voltage Rating (DC): 16V; Length: 0.063inch; Width: 0.031inch; Height: 0.8mm; Thickness: 0.037inch; Lead Free: Lead Free; RoHS Compliant: Yes; ComponentLink1URL: http://search.murata.co.jp/Ceramy/image/img/A01X/G101/ENG/GRM188R61C106MAAL-01.pdf?src-supplier=Digi-Key; ComponentLink1Description: http://search.murata.co.jp/Ceramy/image/img/A01X/G101/ENG/GRM188R61C106MAAL-01.pdf?src-supplier=Digi-Key; ComponentLink2URL: https://search.murata.co.jp/Ceramy/image/img/A01X/G101/ENG/GRM188R61C106MAAL-01.pdf?src-supplier=Digi-Key; ComponentLink2Description: https://search.murata.co.jp/Ceramy/image/img/A01X/G101/ENG/GRM188R61C106MAAL-01.pdf?src-supplier=Digi-Key; ComponentLink3URL: http://search.murata.co.jp/Ceramy/image/img/A01X/partnumbering_e_01.pdf?src-supplier=Digi-Key; ComponentLink3Description: http://search.murata.co.jp/Ceramy/image/img/A01X/partnumbering_e_01.pdf?src-supplier=Digi-Key; Supplier 1: Digi-Key; Supplier 2: Verical; Supplier 3: Mouser; Supplier Part Number 1: 490-10729-1-ND; Supplier Part Number 2: GRM188R61C106MAALD; Supplier Part Number 3: 81-GRM188R61C106MALD
J8 J9 = CONN_HEADER_MALE_2P_2.54_61300211121: THT Vertical Pin Header WR-PHD, Pitch 2.54 mm, Single Row, 2 pins; Manufacturer: Wurth Electronics; Current Rating: 3A; Voltage Rating: 250V; Number of Positions: 2; Gender: 29Gender; Contact Resistance: 20mR; Pitch: 0.1inch; Supplier 1: Digikey; Manufacturer Part Number: 61300211121; RoHS: Yes; Category: Headers and Wire Housings; Stock 1: 91042; Pricing 1: 1=0.13, 10=0.113, 25=0.094, 50=0.079, 100=0.071, 1000=0.065 (USD); Mount: Through Hole; Contact Plating: Gold; Housing Material: PBT; Contact Material: Copper Alloy,Copper; Color: Black; Min Operating Temperature: -40°C; Max Operating Temperature: 125°C; Number of Rows: 1; Contact Gender: Male; Packaging: Bulk; Termination: Through Hole; Number of Contacts: 2; Series: WR-PHD; Contact Type: Male Pin; Operating Supply Voltage: 250V; Orientation: Vertical; Height: 8.94mm; Contact Mating Length: 0.236inch; Lead Free: Lead Free; RoHS Compliant: Yes; Reach SVHC Compliant: Unknown; ComponentLink1URL: https://datasheet.ciiva.com/13619/6130xx11121-48870-13619345.pdf?src-supplier=Mouser; ComponentLink1Description: https://datasheet.ciiva.com/13619/6130xx11121-48870-13619345.pdf?src-supplier=Mouser; Supplier Part Number 1: 732-5315-ND
L4-L6 = IND_FERRITE_BEADS_1K_350mA_BLM15AX102SN1D: Ferrite Beads Multi-Layer 1KOhm 25% 100MHz 350mA 490mOhm DCR 0402 Paper T/R; Manufacturer: Murata; Material: Steel,Ferrite; Number of Lines: 1; DC Resistance (DCR): 490mR; Supplier 1: Digikey; Manufacturer Part Number: BLM15AX102SN1D; RoHS: Yes; Category: Ferrite Beads and Chips; Stock 1: 795930; Pricing 1: 1=0.1, 10=0.05, 25=0.0436, 50=0.039, 100=0.0349, 250=0.03008, 500=0.02682, 1000=0.02381, 5000=0.01775, 10000=0.01546, 20000=0.01375 (USD); Number of Pins: 2; Case Code (Metric): 1005; Case Code (Imperial): 0402; Core Material: Ferrite; Min Operating Temperature: -55°C; Max Operating Temperature: 125°C; Package Quantity: 1; Tolerance: 25%; Packaging: Tape and Reel; Current Rating: 350mA; Max Current Rating: 350mA; Termination: SMD/SMT; Max DC Current: 350mA; Test Frequency: 100MHz; Number of Circuits: 1; Series: BLM15AX_SN; DC Resistance-Max: 490mR; RMS Current (Irms): 350mA; Series Resistance: 490mR; Length: 1mm; Width: 0.5mm; Height: 0.5mm; Depth: 0.5mm; Reach SVHC Compliant: No; Lead Free: Lead Free; RoHS Compliant: Yes; ComponentLink1URL: https://datasheet.ciiva.com/1012/l0110e-1012391.pdf?src-supplier=Digikey; ComponentLink1Description: https://datasheet.ciiva.com/1012/l0110e-1012391.pdf?src-supplier=Digikey; ComponentLink2URL: https://datasheet.ciiva.com/1012/l0110e-1012389.pdf?src-supplier=Digikey; ComponentLink2Description: https://datasheet.ciiva.com/1012/l0110e-1012389.pdf?src-supplier=Digikey; ComponentLink3URL: https://datasheet.ciiva.com/1012/l0110e-1012390.pdf?src-supplier=Digikey; ComponentLink3Description: https://datasheet.ciiva.com/1012/l0110e-1012390.pdf?src-supplier=Digikey; ComponentLink4URL: https://datasheet.ciiva.com/16420/l0110s0100blm15ax-sn-16420798.pdf?src-supplier=Future+Electronics; ComponentLink4Description: https://datasheet.ciiva.com/16420/l0110s0100blm15ax-sn-16420798.pdf?src-supplier=Future+Electronics; Supplier Part Number 1: 490-5442-1-ND
R48 = RES_49.9R_1%_63mW_0402: SMD Chip Resistor, 49.9 Ohm, ± 1%, 63 mW, 0402 [1005 Metric], Thick Film, General Purpose; Manufacturer: Bourns; Power Rating: 62.5mW; Voltage Rating: 50V; Temperature Coefficient: 100ppm/°C; Max Power Dissipation: 63mW; Supplier 1: Digi-Key; Manufacturer Part Number: CR0402-FX-49R9GLF; RoHS: Yes; Category: Chip SMD Resistors; Stock 1: 1080172; Pricing 1: 1=0.1, 10=0.012, 50=0.0064, 100=0.0052, 500=0.00332, 1000=0.0028, 5000=0.00193 (USD); Mount: Surface Mount; Case Code (Metric): 1005; Case Code (Imperial): 0402; Contact Plating: Tin; Min Operating Temperature: -55°C; Max Operating Temperature: 125°C; Packaging: Tape and Reel; Package Quantity: 1; Number of Terminations: 2; Termination: SMD/SMT; Voltage Rating (DC): 50V; Series: CR0402; Length: 0.039inch; Width: 0.5mm; Height: 0.016inch; Thickness: 356um; Radiation Hardening: No; RoHS Compliant: Yes; ComponentLink1URL: https://datasheet.ciiva.com/6562/cr0402-6562967.pdf?src-supplier=Digi-Key; ComponentLink1Description: https://datasheet.ciiva.com/6562/cr0402-6562967.pdf?src-supplier=Digi-Key; Supplier Part Number 1: CR0402-FX-49R9GLFCT-ND
R49-R51 R53-R55 = RES_0R_5%_100mW_0402: SMD Chip Resistor, Jumper, 0 ohm, 100 mW, 0402 [1005 Metric], Thick Film, General Purpose; Manufacturer: Panasonic; Power Rating: 100mW; Voltage Rating: 50V; Temperature Coefficient: 600ppm/°C; Supplier 1: Mouser; Manufacturer Part Number: ERJ-2GE0R00X; RoHS: Yes; Category: Chip SMD Resistors; Stock 1: 10989354; Pricing 1: 1=0.1, 10=0.013, 50=0.013, 100=0.006, 1000=0.004, 2500=0.003, 10000=0.003 (USD); Mount: Surface Mount; Case/Package: 0402; Contact Plating: Tin; Case Code (Metric): 1005; Size Code: 0402; Min Operating Temperature: -55°C; Max Operating Temperature: 155°C; Resistor Type: Thick Film; Packaging: Cut Tape; Package Quantity: 10000; Number of Terminations: 2; Termination: SMD/SMT; Max Power Dissipation: 100mW; Voltage Rating (DC): 50V; Features: Automotive AEC-Q200; Series: ERJ; Construction: Rectangular; Technology: THICK FILM; Length: 1mm; Width: 0.5mm; Height: 0.35mm; Depth: 0.5mm; Ratings: AEC-Q200; Radiation Hardening: No; Reach SVHC Compliant: No; Military Standard: Not; Lead Free: Lead Free; RoHS Compliant: Yes; ComponentLink1URL: https://datasheet.ciiva.com/11821/0900766b80f806dd-11821176.pdf?src-supplier=Rs; ComponentLink1Description: https://datasheet.ciiva.com/11821/0900766b80f806dd-11821176.pdf?src-supplier=Rs; ComponentLink2URL: https://datasheet.ciiva.com/43460/1678796-43460347.pdf?src-supplier=Farnell; ComponentLink2Description: https://datasheet.ciiva.com/43460/1678796-43460347.pdf?src-supplier=Farnell; ComponentLink3URL: https://datasheet.ciiva.com/46389/1678796-46389518.pdf?src-supplier=Element14; ComponentLink3Description: https://datasheet.ciiva.com/46389/1678796-46389518.pdf?src-supplier=Element14; ComponentLink4URL: https://datasheet.ciiva.com/5959/1678796-5959692.pdf?src-supplier=Farnell; ComponentLink4Description: https://datasheet.ciiva.com/5959/1678796-5959692.pdf?src-supplier=Farnell; ComponentLink5URL: https://datasheet.ciiva.com/28695/1678796-28695758.pdf?src-supplier=Element14; ComponentLink5Description: https://datasheet.ciiva.com/28695/1678796-28695758.pdf?src-supplier=Element14; ComponentLink6URL: https://datasheet.ciiva.com/16783/70260739-16783734.pdf?src-supplier=Allied+Electronics; ComponentLink6Description: https://datasheet.ciiva.com/16783/70260739-16783734.pdf?src-supplier=Allied+Electronics; ComponentLink7URL: https://datasheet.ciiva.com/16778/70260739-16778335.pdf?src-supplier=Allied+Electronics; ComponentLink7Description: https://datasheet.ciiva.com/16778/70260739-16778335.pdf?src-supplier=Allied+Electronics; ComponentLink8URL: https://datasheet.ciiva.com/48531/aoa0000ce1-48531077.pdf?src-supplier=Avnet; ComponentLink8Description: https://datasheet.ciiva.com/48531/aoa0000ce1-48531077.pdf?src-supplier=Avnet; ComponentLink9URL: https://datasheet.ciiva.com/30097/4aoa0000ce1-30097116.pdf?src-supplier=Onlinecomponents.com; ComponentLink9Description: https://datasheet.ciiva.com/30097/4aoa0000ce1-30097116.pdf?src-supplier=Onlinecomponents.com; Supplier Part Number 1: 667-ERJ-2GE0R00X
R52 R56 R57 R60 = RES_10K_5%_100mW_0402: Res Thick Film 0402 10K Ohm 5% 1/10W ±200ppm/°C Molded SMD Punched Carrier T/R; Manufacturer: Panasonic; Power Rating: 100mW; Voltage Rating: 50V; Supplier 1: Digi-Key; Manufacturer Part Number: ERJ-2GEJ103X; RoHS: Yes; Category: Chip SMD Resistors; Stock 1: 4696986; Pricing 1: 1=0.1, 10=0.021, 50=0.0132, 100=0.011, 500=0.00744, 1000=0.00639, 5000=0.00464 (USD); Mount: Surface Mount; Contact Plating: Tin; Case Code (Metric): 1005; Case Code (Imperial): 0402; Size Code: 0402; Min Operating Temperature: -55°C; Max Operating Temperature: 155°C; Temperature Coefficient: 200ppm/°C; Packaging: Cut Tape; Resistor Type: Thick Film; Package Quantity: 10000; Number of Terminations: 2; Termination: SMD/SMT; Max Power Dissipation: 100mW; Features: Automotive AEC-Q200; Series: ERJ; Resistance Tolerance: 5%; Technology: THICK FILM; Voltage Rating (DC): 50V; Length: 1mm; Width: 0.5mm; Height: 0.35mm; Depth: 0.5mm; Ratings: AEC-Q200; Radiation Hardening: No; Reach SVHC Compliant: No; RoHS Compliant: Yes; Lead Free: 5697LeadFree; ComponentLink1URL: https://datasheet.ciiva.com/27055/1935721-27055112.pdf?src-supplier=Jameco; ComponentLink1Description: https://datasheet.ciiva.com/27055/1935721-27055112.pdf?src-supplier=Jameco; ComponentLink2URL: https://datasheet.ciiva.com/11821/0900766b80f806dd-11821170.pdf?src-supplier=Rs; ComponentLink2Description: https://datasheet.ciiva.com/11821/0900766b80f806dd-11821170.pdf?src-supplier=Rs; ComponentLink3URL: https://datasheet.ciiva.com/43460/1678796-43460391.pdf?src-supplier=Farnell; ComponentLink3Description: https://datasheet.ciiva.com/43460/1678796-43460391.pdf?src-supplier=Farnell; ComponentLink4URL: https://datasheet.ciiva.com/22785/1678796-22785949.pdf?src-supplier=Farnell; ComponentLink4Description: https://datasheet.ciiva.com/22785/1678796-22785949.pdf?src-supplier=Farnell; ComponentLink5URL: https://datasheet.ciiva.com/46371/1678796-46371910.pdf?src-supplier=Element14; ComponentLink5Description: https://datasheet.ciiva.com/46371/1678796-46371910.pdf?src-supplier=Element14; ComponentLink6URL: https://datasheet.ciiva.com/28514/1678796-28514154.pdf?src-supplier=Element14; ComponentLink6Description: https://datasheet.ciiva.com/28514/1678796-28514154.pdf?src-supplier=Element14; ComponentLink7URL: https://datasheet.ciiva.com/24070/aoa0000ce1-37422-24070679.pdf?src-supplier=Mouser; ComponentLink7Description: https://datasheet.ciiva.com/24070/aoa0000ce1-37422-24070679.pdf?src-supplier=Mouser; ComponentLink8URL: https://datasheet.ciiva.com/16767/70260739-16767130.pdf?src-supplier=Allied+Electronics; ComponentLink8Description: https://datasheet.ciiva.com/16767/70260739-16767130.pdf?src-supplier=Allied+Electronics; ComponentLink9URL: https://datasheet.ciiva.com/16774/70260739-16774504.pdf?src-supplier=Allied+Electronics; ComponentLink9Description: https://datasheet.ciiva.com/16774/70260739-16774504.pdf?src-supplier=Allied+Electronics; ComponentLink10URL: https://datasheet.ciiva.com/9194/aoa0000ce1-9194140.pdf?src-supplier=Avnet; ComponentLink10Description: https://datasheet.ciiva.com/9194/aoa0000ce1-9194140.pdf?src-supplier=Avnet; Supplier Part Number 1: P10KJCT-ND
R58 = RES_402R_1%_100mW_0402: CRCW Series 0603 0.1 W 402 Ohm ±1 % ±100 ppm/K SMT Thick Film Chip Resistor; Manufacturer: Vishay; Power Rating: 100mW; Voltage Rating: 75V; Temperature Coefficient: 100ppm/°C; Supplier 1: Mouser; Manufacturer Part Number: CRCW0603402RFKEA; RoHS: Yes; Category: Chip SMD Resistors; Stock 1: 16183; Pricing 1: 1=0.1, 10=0.017, 50=0.017, 100=0.01, 1000=0.008, 10000=0.004 (USD); Number of Pins: 2; Weight: 7.1E-05oz; Case Code (Metric): 1608; Case Code (Imperial): 0603; Contact Plating: Tin; Size Code: 0603; Min Operating Temperature: -55°C; Max Operating Temperature: 155°C; Packaging: Tape and Reel; Package Quantity: 10; Number of Terminations: 2; Termination: SMD/SMT; Max Power Dissipation: 100mW; Features: Automotive AEC-Q200; Series: CRCW; Resistor Type: Thick Film; Voltage Rating (DC): 75V; Resistance Tolerance: 1%; Construction: Rectangular; Technology: THICK FILM; Length: 1.55mm; Width: 0.033inch; Height: 0.45mm; Depth: 0.85mm; Radiation Hardening: No; Lead Free: Lead Free; RoHS Compliant: Yes; Military Standard: Not; Reach SVHC Compliant: Unknown; ComponentLink1URL: https://datasheet.ciiva.com/11811/0900766b80d98afc-11811706.pdf?src-supplier=Rs; ComponentLink1Description: https://datasheet.ciiva.com/11811/0900766b80d98afc-11811706.pdf?src-supplier=Rs; ComponentLink2URL: https://datasheet.ciiva.com/2465/dcrcwe3-2465870.pdf?src-supplier=Digikey; ComponentLink2Description: https://datasheet.ciiva.com/2465/dcrcwe3-2465870.pdf?src-supplier=Digikey; ComponentLink3URL: https://datasheet.ciiva.com/2465/dcrcwe3-2465871.pdf?src-supplier=Digikey; ComponentLink3Description: https://datasheet.ciiva.com/2465/dcrcwe3-2465871.pdf?src-supplier=Digikey; ComponentLink4URL: https://datasheet.ciiva.com/2465/dcrcwe3-2465872.pdf?src-supplier=Digikey; ComponentLink4Description: https://datasheet.ciiva.com/2465/dcrcwe3-2465872.pdf?src-supplier=Digikey; ComponentLink5URL: https://datasheet.ciiva.com/3257/dcrcwe3-3257562.pdf?src-supplier=Avnet; ComponentLink5Description: https://datasheet.ciiva.com/3257/dcrcwe3-3257562.pdf?src-supplier=Avnet; ComponentLink6URL: https://datasheet.ciiva.com/3257/dcrcwe3-3257563.pdf?src-supplier=Avnet; ComponentLink6Description: https://datasheet.ciiva.com/3257/dcrcwe3-3257563.pdf?src-supplier=Avnet; ComponentLink7URL: https://datasheet.ciiva.com/7881/1697337-7881913.pdf?src-supplier=Element14; ComponentLink7Description: https://datasheet.ciiva.com/7881/1697337-7881913.pdf?src-supplier=Element14; ComponentLink8URL: https://datasheet.ciiva.com/7881/1697337-7881914.pdf?src-supplier=Element14; ComponentLink8Description: https://datasheet.ciiva.com/7881/1697337-7881914.pdf?src-supplier=Element14; ComponentLink9URL: https://datasheet.ciiva.com/22705/1697337-22705175.pdf?src-supplier=Element14; ComponentLink9Description: https://datasheet.ciiva.com/22705/1697337-22705175.pdf?src-supplier=Element14; ComponentLink10URL: https://datasheet.ciiva.com/22871/70201119-22871855.pdf?src-supplier=Allied+Electronics; ComponentLink10Description: https://datasheet.ciiva.com/22871/70201119-22871855.pdf?src-supplier=Allied+Electronics; Supplier Part Number 1: 71-CRCW0603-402-E3
R59 = RES_40.2K_1%_100mW_0603: Res General Purpose Thick Film 0603 40.2K Ohm 1% 1/10W ±100ppm/°C Molded SMD Paper T/R; Manufacturer: Yageo; Power Rating: 100mW; Voltage Rating: 50V; Working Voltage: 75V; Manufacturer Part Number: RC0603FR-0740K2L; RoHS: Yes; Category: Chip SMD Resistors; Stock 1: 594637; Pricing 1: 1=0.10000, 10=0.01900, 100=0.00770, 1000=0.00345, 2500=0.00300 (USD); Mount: Surface Mount; Case Code (Imperial): 0603; Case Code (Metric): 1608; Min Operating Temperature: -55°C; Max Operating Temperature: 155°C; Packaging: Tape and Reel; Termination: SMD/SMT; Resistor Type: Thick Film; Temperature Coefficient: 100ppm/°C; Voltage Rating (DC): 50V; Number of Terminations: 2; Features: Moisture Resistant; Series: RC; Max Power Dissipation: 100mW; Construction: Rectangular; Technology: METAL OXIDE FILM; Length: 1.6mm; Width: 0.8mm; Height: 0.45mm; Depth: 0.8mm; Military Standard: Not; Lead Free: Lead Free; RoHS Compliant: Yes; ComponentLink1URL: https://datasheet.ciiva.com/12555/rc0603-272842-12555385.pdf?src-supplier=Mouser; ComponentLink1Description: https://datasheet.ciiva.com/12555/rc0603-272842-12555385.pdf?src-supplier=Mouser; Supplier 1: Digi-Key; Supplier 2: Newark; Supplier 3: Arrow Electronics; Supplier Part Number 1: 311-40.2KHRCT-ND; Supplier Part Number 2: 82AH8157; Supplier Part Number 3: RC0603FR-0740K2L
SW2 = SWITCH_SPST_NO_RA_PTS645VH83-2LFS: Switch Tactile N.O SPST Round Button PC Pins 0.05A 12VDC 100000Cycle 1.96N Thru-Hole Bulk; Manufacturer: ITT C&K; Mechanical Life: 100000Cycles; Actuator Material: Nylon,Polyamide,PA66; Max Voltage Rating (DC): 12V; Max Current Rating: 50mA; Illumination Type: Non-Illuminated; Switch Function: Off-Mom; Actuator Type: Standard; Supplier 1: Newark; Manufacturer Part Number: PTS645VH83-2LFS; RoHS: Yes; Stock 1: 103123; Pricing 1: 1=0.352 (USD); Mount: Through Hole; Contact Plating: Silver; Contact Material: Bronze; Color: Black; Min Operating Temperature: -20°C; Max Operating Temperature: 60°C; Packaging: Bulk; Operating Force: 1.96N; Throw Configuration: SPST; Termination: PC Pins; Voltage Rating (DC): 12V; Current Rating: 50mA; Package Quantity: 1000; Orientation: Right Angle; Series: PTS645; Length: 7.5mm; Depth: 12.3mm; Radiation Hardening: No; Lead Free: Lead Free; RoHS Compliant: Yes; ComponentLink1URL: https://datasheet.ciiva.com/26930/getdatasheetpartid-759839-26930136.pdf?src-supplier=Verical; ComponentLink1Description: https://datasheet.ciiva.com/26930/getdatasheetpartid-759839-26930136.pdf?src-supplier=Verical; ComponentLink2URL: https://datasheet.ciiva.com/14920/pts645-14920698.pdf?src-supplier=Digikey; ComponentLink2Description: https://datasheet.ciiva.com/14920/pts645-14920698.pdf?src-supplier=Digikey; Supplier Part Number 1: 41AJ9932
TP3 TP4 TP9 = TP_PAD_SMD_Round: Test Point, SMD pad, round, 1.5mm, 1.6mm, 3mm diameter
U7 = IC_MIPI_SERIALIZER_DS90UB953ATRHBTQ1: FPD-Link III 4.16-Gbps serializer with CSI-2 interface 32-VQFN -40 to 125; Manufacturer: Texas Instruments; Data Rate: 4.16Gbps; Number of Inputs: 5; Number of Outputs: 1; Supplier 1: Texas Instruments; Manufacturer Part Number: DS90UB953ATRHBTQ1; RoHS: Yes; Category: Integrated Circuits (ICs); Stock 1: 15937; Pricing 1: 1=10.375, 100=9.063, 250=6.988, 1000=6.25 (USD); Mount: Surface Mount; Case/Package: VQFN; Min Operating Temperature: -40°C; Max Operating Temperature: 125°C; Series: Automotive, AEC-Q100; ComponentLink1URL: http://www.ti.com/general/docs/suppproductinfo.tsp?distId=10&amp;gotoUrl=http%3A%2F%2Fwww.ti.com%2Flit%2Fgpn%2Fds90ub953a-q1&src-supplier=Digikey; ComponentLink1Description: http://www.ti.com/general/docs/suppproductinfo.tsp?distId=10&amp;gotoUrl=http%3A%2F%2Fwww.ti.com%2Flit%2Fgpn%2Fds90ub953a-q1&src-supplier=Digikey; Supplier Part Number 1: DS90UB953ATRHBTQ1
U8 = IC_REG_LDO_1.8V_250mA_LP5907UVX-1.8/NOPB: Low Dropout Regulators(LDO) Positive Fixed 200mV @ 250mA 5.5V 1.8V 250mA DSBGA-4 RoHS; Manufacturer: Texas Instruments; Number of Outputs: 1; Min Input Voltage: 2.2V; Quiescent Current: 25uA; Accuracy: 2%; Dropout Voltage: 50mV; Max Supply Current: 425uA; Power Supply Rejection Ratio (PSRR): 60dB; Supplier 1: Digikey; Manufacturer Part Number: LP5907UVX-1.8/NOPB; RoHS: Yes; Category: Voltage Regulators - Linear; Stock 1: 47909; Pricing 1: 1=0.66, 10=0.564, 25=0.5268, 100=0.4214, 250=0.39128, 500=0.33108, 1000=0.25583 (USD); Mount: Surface Mount; Case/Package: SMD/SMT; Min Operating Temperature: -40°C; Max Operating Temperature: 125°C; Package Quantity: 3000; Packaging: Tape and Reel; Max Input Voltage: 5.5V; Max Output Current: 250mA; Output Voltage: 1.8V; Polarity: Positive; Output Type: Fixed; Series: -; Output Configuration: Positive; Number of Regulators: 1; Min Output Voltage: 1.8V; Output Current: 250mA; Radiation Hardening: No; Lead Free: Lead Free; RoHS Compliant: Yes; ComponentLink1URL: https://datasheet.ciiva.com/6597/lp5907-6597398.pdf?src-supplier=Digikey; ComponentLink1Description: https://datasheet.ciiva.com/6597/lp5907-6597398.pdf?src-supplier=Digikey; ComponentLink2URL: https://datasheet.ciiva.com/14278/lp5907-14278557.pdf?src-supplier=Avnet; ComponentLink2Description: https://datasheet.ciiva.com/14278/lp5907-14278557.pdf?src-supplier=Avnet; Supplier Part Number 1: 296-35634-1-ND
Y3 = CRYSTAL_ABRACON_50MHz_ASDMB-50.000MHZ-LC-T: Oscillator MEMS 50MHz ±50ppm (Stability) 15pF LVCMOS 55% 1.8V/2.5V/3.3V Automotive 4-Pin QFN SMD T/R; Operating Supply Voltage: 3.3V; Max Supply Voltage: 4V; Min Supply Voltage: -300mV; Max Supply Current: 16mA; Supplier 1: Digikey; Manufacturer: Abracon; Manufacturer Part Number: ASDMB-50.000MHZ-LC-T; RoHS: Yes; Category: Oscillators; Stock 1: 1587; Pricing 1: 1=2.76, 10=2.134, 50=2.0774, 100=2.0507, 500=1.5675 (USD); Mount: Surface Mount; Case/Package: SMD/SMT; Number of Pins: 4; Min Operating Temperature: -40°C; Max Operating Temperature: 85°C; Frequency: 50MHz; Load Capacitance: 15pF; Packaging: Tape and Reel; Frequency Stability: 50ppm; Termination: SMD/SMT; Series: ASDMB, Pure Silicon™; Operating Frequency: 50 MHz; Reach SVHC Compliant: No; Lead Free: Lead Free; RoHS Compliant: Yes; ComponentLink1URL: https://datasheet.ciiva.com/871/asdmb-871369.pdf?src-supplier=Digikey; ComponentLink1Description: https://datasheet.ciiva.com/871/asdmb-871369.pdf?src-supplier=Digikey; ComponentLink2URL: https://datasheet.ciiva.com/871/asdmb-871370.pdf?src-supplier=Digikey; ComponentLink2Description: https://datasheet.ciiva.com/871/asdmb-871370.pdf?src-supplier=Digikey; ComponentLink3URL: https://datasheet.ciiva.com/871/asdmb-871371.pdf?src-supplier=Digikey; ComponentLink3Description: https://datasheet.ciiva.com/871/asdmb-871371.pdf?src-supplier=Digikey; ComponentLink4URL: https://datasheet.ciiva.com/48464/asdmb-48464511.pdf?src-supplier=Avnet; ComponentLink4Description: https://datasheet.ciiva.com/48464/asdmb-48464511.pdf?src-supplier=Avnet; Supplier Part Number 1: 535-11738-1-ND